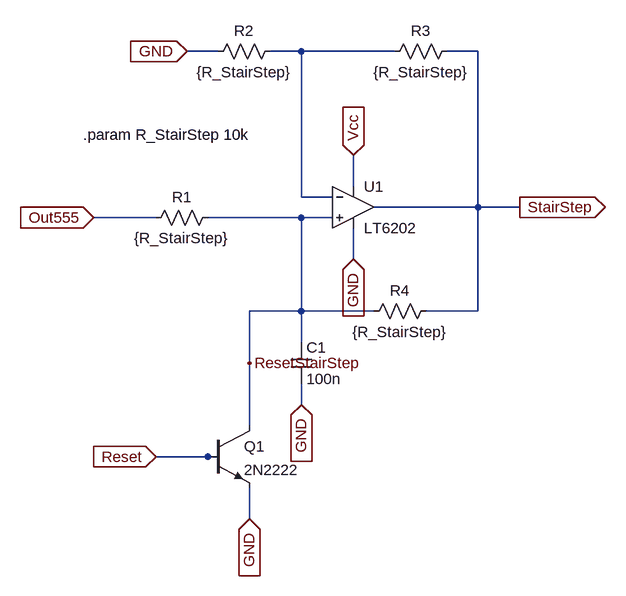
[diagram p0: schematic Mod3_StairStep.asc]
Mod3_StairStep.asc, the LTspice schematic file:
Version 4.1
SHEET 1 880 704
WIRE 16 -128 -32 -128
WIRE 144 -128 96 -128
WIRE 288 -128 144 -128
WIRE 416 -128 368 -128
WIRE 224 80 224 32
WIRE 144 96 144 -128
WIRE 192 96 144 96
WIRE 416 112 416 -128
WIRE 416 112 256 112
WIRE 480 112 416 112
WIRE -80 128 -176 128
WIRE 144 128 0 128
WIRE 192 128 144 128
WIRE 224 192 224 144
WIRE 144 272 144 128
WIRE 144 272 64 272
WIRE 256 272 144 272
WIRE 416 272 416 112
WIRE 416 272 336 272
WIRE 144 320 144 272
WIRE 64 352 64 272
WIRE 144 416 144 384
WIRE 64 448 64 352
WIRE 0 496 -80 496
WIRE 16 496 0 496
WIRE 64 592 64 544
FLAG 224 32 Vcc
IOPIN 224 32 In
FLAG 480 112 StairStep
IOPIN 480 112 Out
FLAG 64 352 ResetStairStep
FLAG -176 128 Out555
IOPIN -176 128 In
FLAG -80 496 Reset
IOPIN -80 496 In
FLAG -32 -128 GND
IOPIN -32 -128 In
FLAG 224 192 GND
IOPIN 224 192 In
FLAG 144 416 GND
IOPIN 144 416 In
FLAG 64 592 GND
IOPIN 64 592 In
SYMBOL npn 0 448 R0
SYMATTR InstName Q1
SYMATTR Value 2N2222
SYMBOL res 16 112 R90
WINDOW 0 0 56 VBottom 2
WINDOW 3 32 56 VTop 2
SYMATTR InstName R1
SYMATTR Value {R_StairStep}
SYMBOL res 112 -144 R90
WINDOW 0 0 56 VBottom 2
WINDOW 3 32 56 VTop 2
SYMATTR InstName R2
SYMATTR Value {R_StairStep}
SYMBOL res 384 -144 R90
WINDOW 0 0 56 VBottom 2
WINDOW 3 32 56 VTop 2
SYMATTR InstName R3
SYMATTR Value {R_StairStep}
SYMBOL res 352 256 R90
WINDOW 0 0 56 VBottom 2
WINDOW 3 32 56 VTop 2
SYMATTR InstName R4
SYMATTR Value {R_StairStep}
SYMBOL cap 128 320 R0
SYMATTR InstName C1
SYMATTR Value 100n
SYMBOL OpAmps\\LT6202 224 112 R0
SYMATTR InstName U1
TEXT -192 0 Left 2 !.param R_StairStep 10k

The netlist it stands for:
* Mod3_StairStep.asc
Q1 ResetStairStep Reset GND 0 2N2222
R1 ResetStairStep Out555 {R_StairStep}
R2 N001 GND {R_StairStep}
R3 StairStep N001 {R_StairStep}
R4 StairStep ResetStairStep {R_StairStep}
C1 ResetStairStep GND 100n
* U1: LT6202 (symbol OpAmps\LT6202 not available, pins judged from their places): In+=ResetStairStep In-=N001 V+=Vcc V-=GND OUT=StairStep
.model NPN NPN
.model PNP PNP
.lib standard.bjt
.param R_StairStep 10k
.backanno
.end